# EAGLE design Keys10_1V0 (EAGLE 7.6.0)

## Sheet 1 of 2
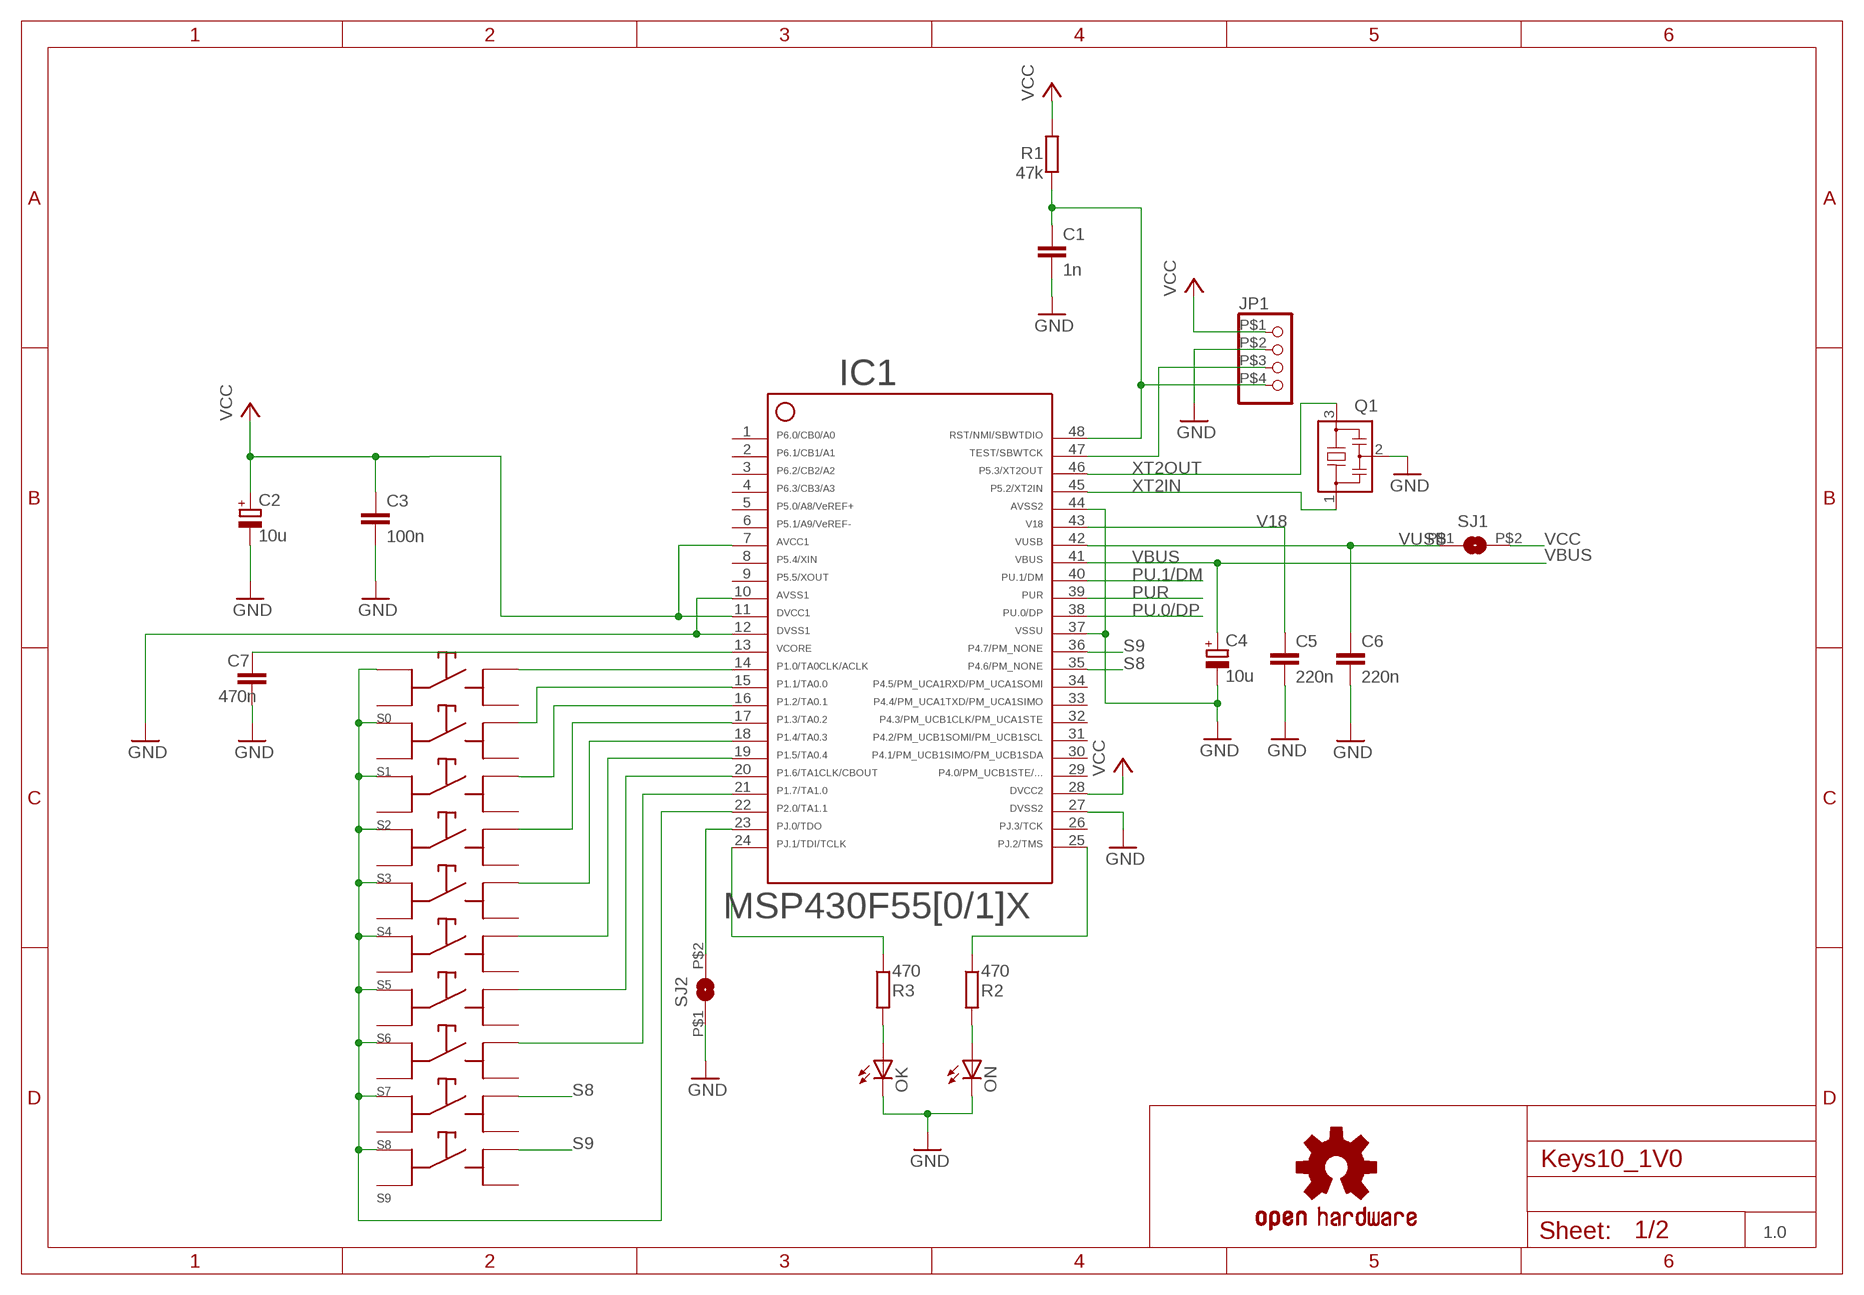
[diagram p0: schematic, sheet 1]
FRAME1 (A4L-LOC): VERSION: 1.0

### Parts
C1  1n  C-EUC0805  [C0805]
C2  10u  CPOL-EUR/2012-12R  [R/2012-12R]
C3  100n  C-EUC0805  [C0805]
C4  10u  CPOL-EUR/2012-12R  [R/2012-12R]
C5  220n  C-EUC0805  [C0805]
C6  220n  C-EUC0805  [C0805]
C7  470n  C-EUC0805  [C0805]
IC1  F5509  F55[0/1]X---PT48  [PT48]
JP1  PINHD-1X4S  [1X04S]
OK  LEDCHIPLED_0805  [CHIPLED_0805]
ON  LEDCHIPLED_0805  [CHIPLED_0805]
Q1  PIEZO_CSTCR4M00G15L99  CSTCR6M00G53Z  [CSTCR6M]
R1  47k  R-EU_R0805  [R0805]
R2  470  R-EU_R0805  [R0805]
R3  470  R-EU_R0805  [R0805]
S0  HDKJ  [HDKJ]
S1  HDKJ  [HDKJ]
S2  HDKJ  [HDKJ]
S3  HDKJ  [HDKJ]
S4  HDKJ  [HDKJ]
S5  HDKJ  [HDKJ]
S6  HDKJ  [HDKJ]
S7  HDKJ  [HDKJ]
S8  HDKJ  [HDKJ]
S9  HDKJ  [HDKJ]
SJ1  SJM  [SJ_M]
SJ2  SJM  [SJ_M]
U$1  OSHW_LOGO_SYMS  [OSHW_LOGO_SMALL_SYM]

### Nets
GND [Ground]: C1.2 C2.- C3.2 C4.- C5.2 C6.2 C7.2 IC1.10 IC1.12 IC1.27 IC1.37 IC1.44 JP1.P$2 OK.C ON.C Q1.2 SJ2.P$1 ; also sheet 2
LED1: ON.A R2.2
LED_OK: IC1.24 R3.1
LED_ON: IC1.25 R2.1
N$1: IC1.23 SJ2.P$2
N$2: OK.A R3.2
PU.0/DP: IC1.38 ; also sheet 2
PU.1/DM: IC1.40 ; also sheet 2
PUR: IC1.39 ; also sheet 2
RST: C1.1 IC1.48 JP1.P$4 R1.1
S0: IC1.14 S0.OU1(OUT1)
S1: IC1.15 S1.OU1(OUT1)
S2: IC1.16 S2.OU1(OUT1)
S3: IC1.17 S3.OU1(OUT1)
S4: IC1.18 S4.OU1(OUT1)
S5: IC1.19 S5.OU1(OUT1)
S6: IC1.20 S6.OU1(OUT1)
S7: IC1.21 S7.OU1(OUT1)
S8: IC1.35 S8.OU1(OUT1)
S9: IC1.36 S9.OU1(OUT1)
SC [Ground]: IC1.22 S0.IN1 S1.IN1 S2.IN1 S3.IN1 S4.IN1 S5.IN1 S6.IN1 S7.IN1 S8.IN1 S9.IN1
TST: IC1.47 JP1.P$3
V18: C5.1 IC1.43
VBUS: C4.+ IC1.41 ; also sheet 2
VCC: C2.+ C3.1 IC1.7 IC1.11 IC1.28 JP1.P$1 R1.2 SJ1.P$2 ; also sheet 2
VCORE: C7.1 IC1.13
VUSB: C6.1 IC1.42 SJ1.P$1
XT2IN: IC1.45 Q1.1
XT2OUT: IC1.46 Q1.3
Unconnected: IC1.1 IC1.2 IC1.3 IC1.4 IC1.5 IC1.6 IC1.8 IC1.9 IC1.26 IC1.29 IC1.30 IC1.31 IC1.32 IC1.33 IC1.34 S0.IN2 S0.OUT2 S1.IN2 S1.OUT2 S2.IN2 S2.OUT2 S3.IN2 S3.OUT2 S4.IN2 S4.OUT2 S5.IN2 S5.OUT2 S6.IN2 S6.OUT2 S7.IN2 S7.OUT2 S8.IN2 S8.OUT2 S9.IN2 S9.OUT2

## Sheet 2 of 2
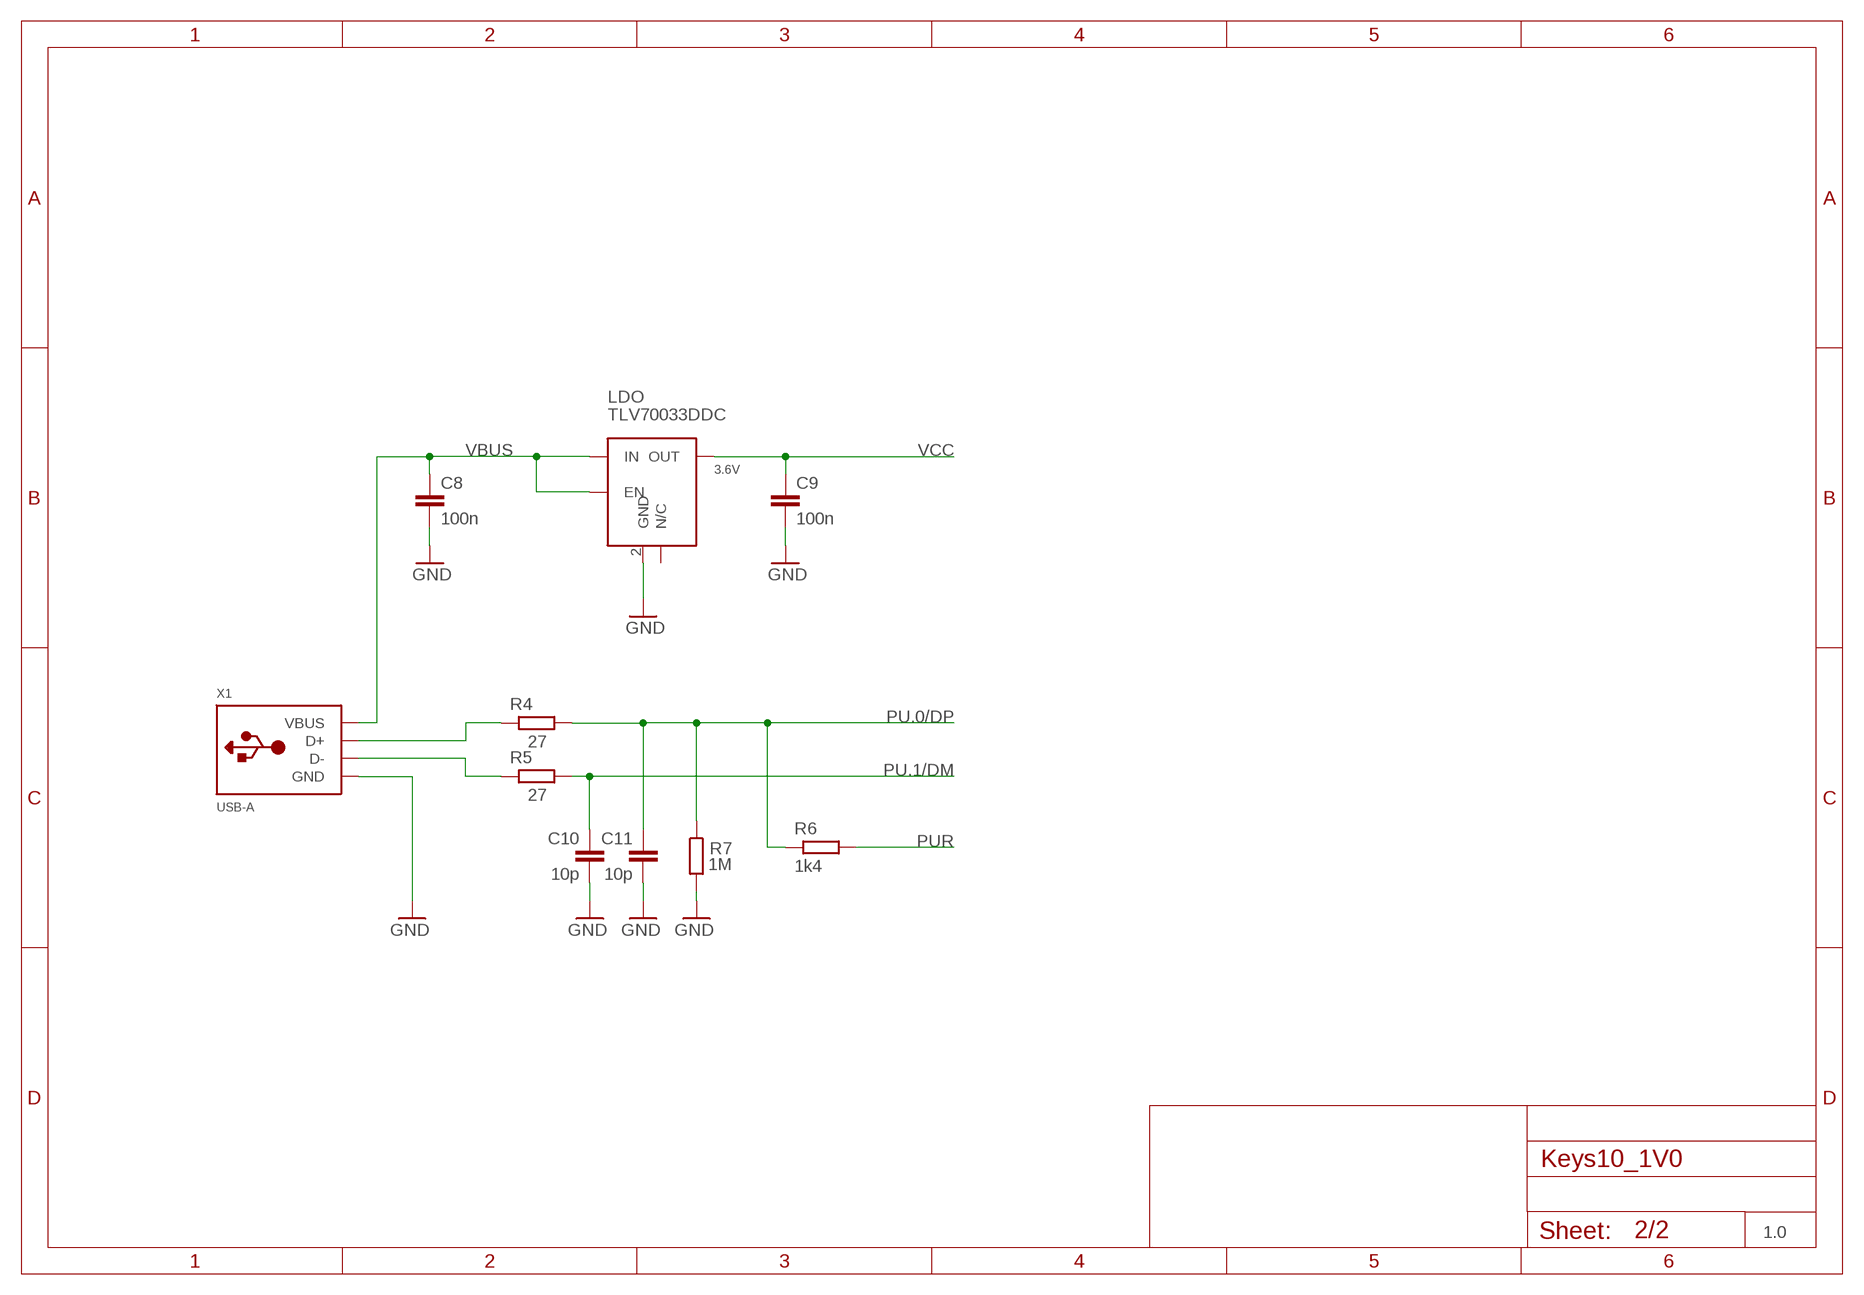
[diagram p1: schematic, sheet 2]
FRAME2 (A4L-LOC): VERSION: 1.0

### Parts
C8  100n  C-EUC0805  [C0805]
C9  100n  C-EUC0805  [C0805]
C10  10p  C-EUC0805  [C0805]
C11  10p  C-EUC0805  [C0805]
LDO  TLV70033DDC  TLV700XXDDC  [SOT23-5]
R4  27  R-EU_R0805  [R0805]
R5  27  R-EU_R0805  [R0805]
R6  1k4  R-EU_R0805  [R0805]
R7  1M  R-EU_R0805  [R0805]
X1  USB-A  [MOLEX_480371000]

### Nets
EZFET_DM: R5.1 X1.2(D-)
EZFET_DP: R4.1 X1.3(D+)
GND [Ground]: C8.2 C9.2 C10.2 C11.2 LDO.2(GND) R7.2 X1.4(GND) X1.M1(GND) X1.M2(GND) ; also sheet 1
PU.0/DP: C11.1 R4.2 R6.1 R7.1 ; also sheet 1
PU.1/DM: C10.1 R5.2 ; also sheet 1
PUR: R6.2 ; also sheet 1
VBUS: C8.1 LDO.1(IN) LDO.3(EN) X1.1(VBUS) ; also sheet 1
VCC: C9.1 LDO.5(OUT) ; also sheet 1
Unconnected: LDO.4(N/C)

## Library data of the parts
C1 C3 C5-C11 = rcl:C-EU: CAPACITOR, European symbol
C2 C4 = rcl:CPOL-EU: POLARIZED CAPACITOR, European symbol
IC1 = TI_MSP430_v16_intern:F55[0/1]X---PT48: ***F55[0/1/2]X*** PT48 Rev. 1.0 06/2010 "http://www.ti.com/lit/gpn/msp430f5509" Only for FF5504, F5508,F5509,F5510
JP1 = pinhead02:PINHD-1X4: PIN HEADER
LDO = Spannungsregler:TLV700XX
OK ON = led:LED: LED OSRAM: - CHIPLED LG R971, LG N971, LY N971, LG Q971, LY Q971, LO R971, LY R971 LH N974, LH R974 LS Q976, LO Q976, LY Q976 LO Q996 - Hyper CHIPLED LW Q18S LB Q993, LB Q99A, LB R99A - SideLED LS A670, LO A670, LY A670, LG A670, LP A670 LB A673, LV A673, LT A673, LW A673 LH A674 LY A675 LS A676, LA A676, LO A676, LY A676, LW A676 LS A679, LY A679, LG A679 - Hyper Micro SIDELED® LS Y876, LA Y876, LO Y876, LY Y876 LT Y87S - SmartLED LW L88C, LW L88S LB L89C, LB L89S, LG L890 LS L89K, LO L89K, LY L89K LS L896, LA L896, LO L896, LY L896 - TOPLED LS T670, LO T670, LY T670, LG T670, LP T670 LSG T670, LSP T670, LSY T670, LOP T670, LYG T670 LG T671, LOG T671, LSG T671 LB T673, LV T673, LT T673, LW T673 LH T674 LS T676, LA T676, LO T676, LY T676, LB T676, LH T676, LSB T676, LW T676 LB T67C, LV T67C, LT T67C, LS T67K, LO T67K, LY T67K, LW E67C LS E67B, LA E67B, LO E67B, LY E67B, LB E67C, LV E67C, LT E67C LW T67C LS T679, LY T679, LG T679 LS T770, LO T770, LY T770, LG T770, LP T770 LB T773, LV T773, LT T773, LW T773 LH T774 LS E675, LA E675, LY E675, LS T675 LS T776, LA T776, LO T776, LY T776, LB T776 LHGB T686 LT T68C, LB T68C - Hyper Mini TOPLED® LB M676 - Mini TOPLED Santana® LG M470 LS M47K, LO M47K, LY M47K Source: http://www.osram.convergy.de LUXEON: - LUMILED® LXK2-PW12-R00, LXK2-PW12-S00, LXK2-PW14-U00, LXK2-PW14-V00 LXK2-PM12-R00, LXK2-PM12-S00, LXK2-PM14-U00 LXK2-PE12-Q00, LXK2-PE12-R00, LXK2-PE12-S00, LXK2-PE14-T00, LXK2-PE14-U00 LXK2-PB12-K00, LXK2-PB12-L00, LXK2-PB12-M00, LXK2-PB14-N00, LXK2-PB14-P00, LXK2-PB14-Q00 LXK2-PR12-L00, LXK2-PR12-M00, LXK2-PR14-Q00, LXK2-PR14-R00 LXK2-PD12-Q00, LXK2-PD12-R00, LXK2-PD12-S00 LXK2-PH12-R00, LXK2-PH12-S00 LXK2-PL12-P00, LXK2-PL12-Q00, LXK2-PL12-R00 Source: www.luxeon.com KINGBRIGHT: KA-3528ASYC Source: www.kingbright.com
Q1 = murata-filter:CSTCR: Resonator Source: murata.co.jp; MPN: CSTCR6M00G53-R0; OC_FARNELL: 1170434; OC_NEWARK: 25M8759
R1-R7 = rcl:R-EU_: RESISTOR, European symbol
S0 S1-S9 = Taster:HDKJ: Taster 1xEIN
SJ1 SJ2 = jumper:SJ: SMD solder JUMPER
U$1 = PatternAgents-Logos:OSHW_LOGO_SYM: OSHW_LOGO_SYM Source : http://freedomdefined.org/OSHW#Logo_repository Github : https://github.com/PatternAgents/PCB_Libraries License : http://creativecommons.org/licenses/by-sa/3.0/ (Creative Commons 3.0) THIS SOFTWARE IS PROVIDED BY THE CONTRIBUTORS "AS IS" AND WITHOUT ANY EXPRESS OR IMPLIED WARRANTIES, INCLUDING, BUT NOT LIMITED TO, THE IMPLIED WARRANTIES OF MERCHANTABILITY AND FITNESS FOR A PARTICULAR PURPOSE ARE DISCLAIMED. IN NO EVENT SHALL THE COPYRIGHT OWNER OR CONTRIBUTORS BE LIABLE FOR ANY DIRECT, INDIRECT, INCIDENTAL, SPECIAL, EXEMPLARY, OR CONSEQUENTIAL DAMAGES (INCLUDING, BUT NOT LIMITED TO, PROCUREMENT OF SUBSTITUTE GOODS OR SERVICES; LOSS OF USE, DATA, OR PROFITS; OR BUSINESS INTERRUPTION) HOWEVER CAUSED AND ON ANY THEORY OF LIABILITY, WHETHER IN CONTRACT, STRICT LIABILITY, OR TORT (INCLUDING NEGLIGENCE OR OTHERWISE) ARISING IN ANY WAY OUT OF THE USE OF THIS SOFTWARE, EVEN IF ADVISED OF THE POSSIBILITY OF SUCH DAMAGE.
X1 = Adafruit:USB-A: USB type A 'plug' Used for things that can directly connect to a USB port, say USB key

## Net classes
0 default: width 0.254 mm
1 Ground: width 0.1 mm, drill 0.2 mm

## Board
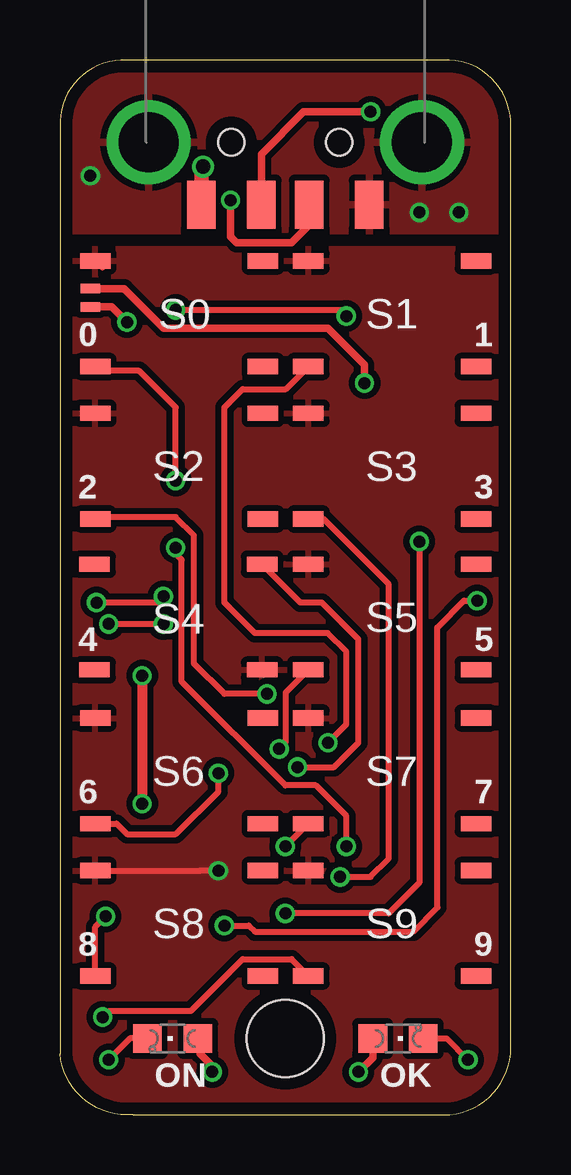
[diagram p2: board, top side]
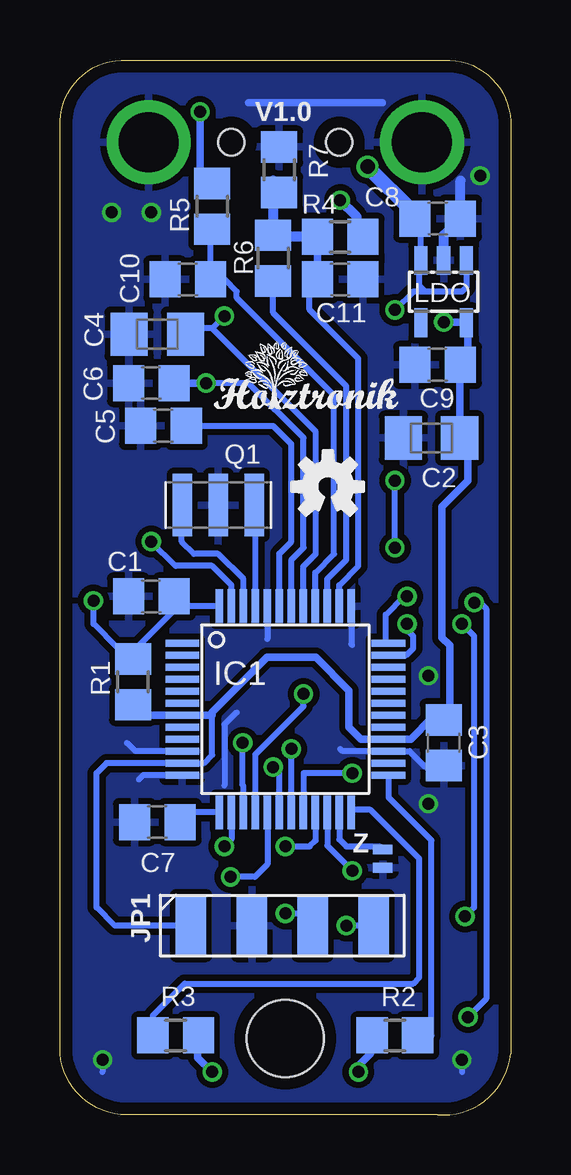
[diagram p3: board, bottom side, seen from below]

Size 18.8 x 43.95 mm. Coordinates in mm from the lower left corner, seen from the top.
Outline: 3.05,0.01 15.75,0.01 arc90 18.8,2.55 18.8,41.41 arc90 16,43.95 2.54,43.95 arc90 0,41.16 0,2.55 arc90 3.05,0.01
Copper layers (1*16): Top 0.035mm / dielectric 1.6mm / Bottom 0.035mm
Design rules "Elecrow_2-layer_PCB_eagle_rule": minimum track width 6mil, minimum drill 12mil, track to track 6mil, track to pad 6mil, pad to pad 6mil, via to via 8mil, smd to smd 0mil, copper to edge 20mil, drill to drill 10mil, minimum pad ring 6mil, minimum via ring 6mil, stop-mask expansion 0mil, vias tented up to drill 100mil, thermal gap 10mil
Holes 3.2 mm at 9.4,3.19

### Footprints (pad centres in the part's own frame; a part is rotated, then mirrored left to right if it is on the bottom)
C0805 = smd 1.3 x 1.5: 1 -0.95,0; 2 0.95,0
R/2012-12R = smd 1.55 x 1.8: + 1.175,0; - -1.175,0
PT48 = smd 1.4 x 0.3: 1 -4.3,2.75; 2 -4.3,2.25; 3 -4.3,1.75; 4 -4.3,1.25; 5 -4.3,0.75; 6 -4.3,0.25; 7 -4.3,-0.25; 8 -4.3,-0.75; 9 -4.3,-1.25; 10 -4.3,-1.75; 11 -4.3,-2.25; 12 -4.3,-2.75; 25 4.3,-2.75; 26 4.3,-2.25; 27 4.3,-1.75; 28 4.3,-1.25; 29 4.3,-0.75; 30 4.3,-0.25; 31 4.3,0.25; 32 4.3,0.75; 33 4.3,1.25; 34 4.3,1.75; 35 4.3,2.25; 36 4.3,2.75 | smd 0.3 x 1.4: 13 -2.75,-4.3; 14 -2.25,-4.3; 15 -1.75,-4.3; 16 -1.25,-4.3; 17 -0.75,-4.3; 18 -0.25,-4.3; 19 0.25,-4.3; 20 0.75,-4.3; 21 1.25,-4.3; 22 1.75,-4.3; 23 2.25,-4.3; 24 2.75,-4.3; 37 2.75,4.3; 38 2.25,4.3; 39 1.75,4.3; 40 1.25,4.3; 41 0.75,4.3; 42 0.25,4.3; 43 -0.25,4.3; 44 -0.75,4.3; 45 -1.25,4.3; 46 -1.75,4.3; 47 -2.25,4.3; 48 -2.75,4.3
1X04S = smd 1.27 x 2.54: P$1 0,0; P$2 2.54,0; P$3 5.08,0; P$4 7.62,0
SOT23-5 = smd 0.55 x 1.2: 1 -0.95,-1.3; 2 0,-1.3; 3 0.95,-1.3; 4 0.95,1.3; 5 -0.95,1.3
CHIPLED_0805 = smd 1.2 x 1.2: A 0,-1.05; C 0,1.05
CSTCR6M = smd 0.8 x 2.6: 1 -1.5,0; 2 0,0; 3 1.5,0
R0805 = smd 1.3 x 1.5: 1 -0.95,0; 2 0.95,0
HDKJ = smd 1.27 x 0.635: IN1 -3.48,2.17; IN2 3.51,2.17; OU1 -3.48,-2.23; OUT2 3.51,-2.23
SJ_M = smd 0.406 x 0.813: P$1 -0.381,0; P$2 0.381,0
MOLEX_480371000 = smd 1.2 x 2: 1 3.5,2.6; 2 1,2.6; 3 -1,2.6; 4 -3.5,2.6 | drill 2.5: M1 -5.7,0; M2 5.7,0 | hole 1.1: -2.25,0; 2.25,0

### Placement (x,y rotation side)
C1  14.99,21.6 180 bottom
C2  3.3,28.21 0 bottom
C3  2.79,15.51 270 bottom
C4  14.73,32.52 0 bottom
C5  14.48,28.71 180 bottom
C6  14.99,30.49 180 bottom
C7  14.73,12.2 180 bottom
C8  3.05,37.35 0 bottom
C9  3.05,31.25 180 bottom
C10  13.46,34.81 180 bottom
C11  7.11,34.81 0 bottom
IC1  9.4,16.9 0 bottom
JP1  13.34,7.89 0 bottom
LDO  2.79,34.3 180 bottom
OK  14.1,3.19 270 top
ON  4.7,3.19 90 top
Q1  12.19,25.41 180 bottom
R1  15.75,18.05 270 bottom
R2  4.83,3.31 180 bottom
R3  13.97,3.31 0 bottom
R4  7.11,36.59 180 bottom
R5  12.45,37.86 270 bottom
R6  9.91,35.7 270 bottom
R7  9.65,39.38 90 bottom
S0  4.95,33.41 0 top
S1  13.84,33.41 0 top
S2  4.95,27.06 0 top
S3  13.84,27.06 0 top
S4  4.95,20.71 180 top
S5  13.84,20.78 0 top
S6  4.95,14.36 0 top
S7  13.84,14.36 0 top
S8  4.95,8.01 0 top
S9  13.84,8.01 0 top
SJ1  1.27,34.05 270 top
SJ2  5.33,10.68 90 bottom
U$1  7.62,26.17 0 bottom
U$3  [HOLZTRONIK3]  12.7,28.97 0 bottom
X1  9.4,40.52 180 top

### Tracks (layer width: path | path; a pad name or v marks a point on that pad's centre or on a via)
EZFET_DM  (via drill 0.5)
  Top 0.305: X1.2 8.4,40.03 10.16,41.79 v12.95,41.79
  Bottom 0.305: R5.1 12.95,39.13 v12.95,41.79
EZFET_DP  (via drill 0.5)
  Top 0.305: v7.11,38.11 7.11,36.59 7.37,36.33 9.65,36.33 10.41,37.1 10.41,37.91 X1.3
  Bottom 0.305: R4.1 6.42,37.16
  Bottom 0.406: 6.42,37.16 6.42,37.42 v7.11,38.11
GND  (via drill 0.5)
  Top 0.254: ON.C 2.92,3.19 v2.03,2.3 | OK.C 16.13,3.19 v17.02,2.3
  Top 0.406: v3.43,18.3 v3.43,12.97
  Top 0.61: X1.4 12.9,38.32
  Bottom 0.254: v2.03,2.3 2.03,1.79 | v17.02,2.3 17.02,1.79 | IC1.44 10.15,19.84 10.16,19.82 | IC1.37 6.65,19.61 6.6,19.57 | IC1.10 15.65,15.15 16,15.51 | IC1.12 15.32,14.15 15.49,13.98 | C3.2 2.86,14.49 3.56,14.49 4.22,15.15 IC1.27 7.01,15.15 7.11,15.25 | 11.43,16.78 11.94,16.27 11.94,13.73
  Bottom 0.305: 10.92,42.18 5.35,42.18
  Bottom 0.406: 2.1,38.92 C8.2 2.79,36.65 LDO.2 | X1.M1 15.1,40.54
  other vias: 14.99,37.6 16.64,37.6 1.27,39.13
  pour Bottom (isolate 0.254): 0,0.01 18.8,0.01 18.8,43.95 0,43.95
  pour Top (isolate 0.254): 0,36.84 0,43.95 18.8,43.95 18.8,36.84
LED1  (via drill 0.5)
  Top 0.305: R2.2 5.75,3.29 ON.A 5.84,3.09 5.84,2.55 6.35,2.04 v6.35,1.79
  Bottom 0.305: R2.2 5.84,3.25 5.84,2.55 6.35,2.04 v6.35,1.79
LED_OK
  Bottom 0.254: R3.1 14.92,4.14 13.59,5.47 4.06,5.47 3.81,5.73 3.81,10.68 5.84,12.71 6.54,12.71 IC1.24
LED_ON
  Bottom 0.254: R2.1 3.3,3.31 3.3,11.44 5.08,13.22 5.08,14.13 IC1.25
N$1
  Bottom 0.254: IC1.23 7.15,11.48 6.86,11.19 5.46,11.19 SJ2.P$2
N$2  (via drill 0.5)
  Top 0.305: R3.2 13.05,3.29 OK.A 13.05,2.39 v12.45,1.79
  Bottom 0.305: R3.2 13.05,3.29 13.05,2.39 v12.45,1.79
PU.0/DP
  Bottom 0.254: IC1.38 7.15,22.07 6.35,22.87 6.35,31.51 8.38,33.54 8.38,34.74 C11.1
  Bottom 0.305: C11.1 R4.2 | 10.09,36.84 R6.1
  Bottom 0.406: R4.2 9.97,36.59 R6.1 9.91,38.94 R7.1
PU.1/DM
  Bottom 0.254: IC1.40 8.15,22.6 7.37,23.38 7.37,29.98 11.43,34.05 11.43,34.3 11.94,34.81 C10.1 12.51,36.84 R5.2
PUR
  Bottom 0.254: IC1.39 7.65,22.34 6.86,23.13 6.86,30.36 9.91,33.41 R6.2
RST  (via drill 0.5)
  Top 0.254: v6.86,7.89 7.87,7.89 8.13,7.63 14.73,7.63 15.75,8.65 15.74,20.31 16.85,21.42 v17.4,21.42
  Bottom 0.254: IC1.48 13.38,21.2 13.62,21.44 | 13.62,21.44 C1.1 | 13.62,21.44 15.81,19.25 R1.1 15.75,19.5 | JP1.P$4 v6.86,7.89 | 15.75,19.5 15.94,19.5 | 15.75,19.5 15.81,19.44 16.38,19.44 17.4,20.46 v17.4,21.42
S0  (via drill 0.5)
  Top 0.254: v11.94,11.19 11.94,12.46 10.67,13.73 9.4,13.73 5.08,18.05 5.08,23.13 4.83,23.38 v4.83,23.63 | v4.83,26.43 4.83,29.48 3.3,31 1.66,31 S0.OU1
  Bottom 0.254: IC1.14 11.65,11.48 v11.94,11.19 | v4.83,23.63 v4.83,26.43
S1  (via drill 0.5)
  Top 0.254: v11.18,15.51 11.94,16.27 11.94,19.32 11.18,20.08 8.13,20.08 6.86,21.35 6.86,29.48 7.62,30.24 9.42,30.24 S1.OU1
  Bottom 0.254: IC1.15 11.15,13.7 11.18,13.73 v11.18,15.51
S2  (via drill 0.5)
  Top 0.254: v8.64,17.54 6.86,17.54 5.59,18.81 5.59,24.14 4.83,24.9 1.54,24.9 S2.OU1
  Bottom 0.254: IC1.16 10.65,15.02 8.64,17.03 v8.64,17.54
S3  (via drill 0.5)
  Top 0.254: v11.68,9.92 12.95,9.92 13.72,10.68 13.72,22.11 10.99,24.83 S3.OU1
  Bottom 0.254: IC1.17 10.15,10.44 10.67,9.92 v11.68,9.92
S4  (via drill 0.5)
  Top 0.254: v9.91,14.49 11.43,14.49 12.45,15.51 12.45,19.82 10.92,21.35 10.03,21.35 S4.OU1
  Bottom 0.254: IC1.18 9.65,14.23 v9.91,14.49
S5  (via drill 0.5)
  Top 0.254: v9.14,15.25 9.42,15.53 9.42,17.61 S5.OU1
  Bottom 0.254: IC1.19 9.15,15 v9.14,15.25
S6  (via drill 0.5)
  Top 0.254: S6.OU1 2.36,12.13 2.79,11.7 4.83,11.7 6.6,13.47 v6.6,14.24
  Bottom 0.254: v6.6,14.24 8.64,14.24 8.64,12.61 IC1.20
S7  (via drill 0.5)
  Top 0.254: S7.OU1 10.34,12.13 v9.4,11.19
  Bottom 0.254: v9.4,11.19 8.38,11.19 8.13,11.44 8.15,11.46 IC1.21
S8  (via drill 0.5)
  Top 0.254: S8.OU1 1.47,7.83 v1.91,8.27 | v2.03,20.46 v4.32,20.46
  Bottom 0.254: v1.91,8.27 1.52,8.65 1.52,19.95 v2.03,20.46 | IC1.35 4.35,19.15 4.06,19.44 4.06,19.95 4.32,20.2 v4.32,20.46
S9  (via drill 0.5)
  Top 0.254: v4.32,21.6 4.06,21.35 v1.52,21.35 | v1.78,4.08 2.03,4.33 5.46,4.33 7.62,6.49 9.66,6.49 S9.OU1
  Bottom 0.254: v1.52,21.35 1.27,21.35 1.02,21.09 1.02,4.84 v1.78,4.08 | IC1.36 5.21,19.76 5.21,20.84 4.45,21.6 v4.32,21.6
SC  (via drill 0.5)
  Top 0.254: S0.IN1 1.51,35.58 1.78,35.32 | v6.6,10.17 5.84,10.17 5.83,10.18 S8.IN1
  Bottom 0.254: IC1.22 7.65,11.22 v6.6,10.17
  pour Top (isolate 0.254): 0,0.01 0,36.08 18.8,36.08 18.8,0.01
TST  (via drill 0.5)
  Top 0.254: v14.99,23.89 14.99,9.66 13.72,8.39 v9.4,8.39
  Bottom 0.254: IC1.47 11.65,22.07 12.45,22.87 13.97,22.87 v14.99,23.89 | v9.4,8.39 8.76,8.39 JP1.P$3
V18
  Bottom 0.254: C5.1 9.91,28.71 9.14,27.95 9.14,23.89 9.65,23.38 IC1.43
VBUS  (via drill 0.5, 0.6)
  Top 0.254: v4.83,33.54 11.68,33.54 v11.94,33.29
  Top 0.61: X1.1 5.9,39.44 v5.97,39.51
  Bottom 0.254: IC1.41 8.65,22.86 8.13,23.38 8.13,28.46 12.45,32.78 | 12.45,32.78 13.05,32.78 C4.+ | C8.1 3.74,37.1 LDO.3 3.81,35.54 3.81,34.56 3.56,34.3 | LDO.1 1.84,34.49 2.03,34.3 3.56,34.3 | 3.56,34.3 4.06,34.3 v4.83,33.54 | v11.94,33.29 12.45,32.78
  Bottom 0.61: C8.1 4.06,37.6 v5.97,39.51
VCC  (via drill 0.5)
  Top 0.305: SJ1.P$2 2.16,33.67 v2.79,33.03
  Bottom 0.254: 3.3,16.52 2.35,16.27 C3.1 2.54,16.71 | 12.45,16.65 12.45,15 12.79,14.65 IC1.11 16.86,14.65 17.27,14.24 17.27,8.65 16.51,7.89 JP1.P$1 | 15.56,16.65 R1.2 | 1.78,28.11 C2.+ | 1.87,30.97 C9.1
  Bottom 0.305: 3.3,16.52 4.17,15.65 IC1.28 6.24,15.65 6.74,16.14 6.74,17.67 8.13,19.06 10.16,19.06 12.45,16.78 12.45,16.65 IC1.7 15.56,16.65 | 1.78,28.11 1.78,26.43 2.86,25.35 2.86,19.89 2.54,19.57 2.54,16.71 | C9.1 2.1,31.19 1.78,31.51 1.78,32.94 LDO.5 1.87,33.03 v2.79,33.03 | 1.87,30.97 2.13,30.72 C2.+
VCORE
  Bottom 0.254: IC1.13 13.38,12.6 C7.1
VUSB  (via drill 0.5)
  Top 0.305: SJ1.P$1 2.67,34.43 4.32,32.78 11.18,32.78 12.7,31.25 v12.7,30.49
  Bottom 0.254: IC1.42 9.15,23.12 8.64,23.63 8.64,28.21 10.92,30.49 v12.7,30.49
  Bottom 0.305: v12.7,30.49 C6.1
XT2IN
  Bottom 0.254: IC1.45 10.65,24.67 10.67,24.65 10.67,25.39 Q1.1
XT2OUT
  Bottom 0.254: IC1.46 11.15,22.34 12.19,23.38 13.21,23.38 13.72,23.89 13.72,26.15 Q1.3

### Text on the board
tNames: 0 | 1 | 2 | 3 | 4 | 5 | 6 | 7 | 8 | 9
bNames: V1.0 | Z